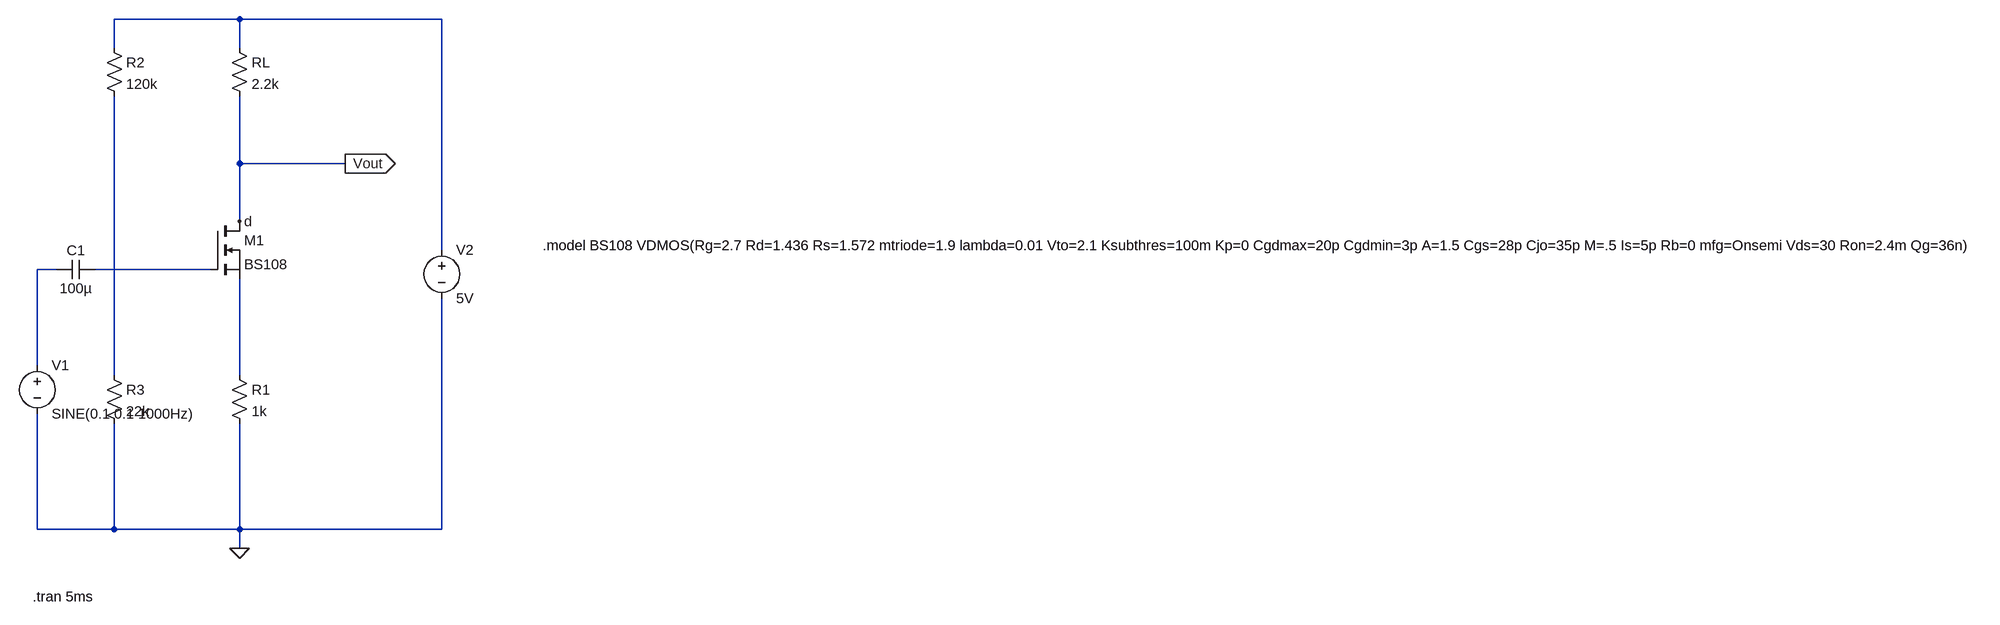
[diagram p0: schematic MOSFETasSwitchAndAmplifier.asc]
MOSFETasSwitchAndAmplifier.asc, the LTspice schematic file:
Version 4
SHEET 1 3668 784
WIRE 208 -304 0 -304
WIRE 544 -304 208 -304
WIRE 0 -256 0 -304
WIRE 208 -256 208 -304
WIRE 208 -64 208 -176
WIRE 384 -64 208 -64
WIRE 208 32 208 -64
WIRE 544 80 544 -304
WIRE -96 112 -128 112
WIRE 160 112 -32 112
WIRE -128 272 -128 112
WIRE 0 288 0 -176
WIRE 208 288 208 128
WIRE -128 544 -128 352
WIRE 0 544 0 368
WIRE 0 544 -128 544
WIRE 208 544 208 368
WIRE 208 544 0 544
WIRE 544 544 544 160
WIRE 544 544 208 544
WIRE 208 576 208 544
FLAG 208 32 d
FLAG 208 576 0
FLAG 384 -64 Vout
IOPIN 384 -64 Out
SYMBOL res 192 -272 R0
SYMATTR InstName RL
SYMATTR Value 2.2k
SYMBOL nmos 160 32 R0
SYMATTR InstName M1
SYMATTR Value BS108
SYMBOL voltage -128 256 R0
SYMATTR InstName V1
SYMATTR Value SINE(0.1 0.1 1000Hz)
SYMATTR Value2 AC 0.1
SYMBOL res 192 272 R0
SYMATTR InstName R1
SYMATTR Value 1k
SYMBOL res -16 -272 R0
SYMATTR InstName R2
SYMATTR Value 120k
SYMBOL res -16 272 R0
SYMATTR InstName R3
SYMATTR Value 22k
SYMBOL voltage 544 64 R0
SYMATTR InstName V2
SYMATTR Value 5V
SYMBOL cap -32 96 R90
WINDOW 0 0 32 VBottom 2
WINDOW 3 32 32 VTop 2
SYMATTR InstName C1
SYMATTR Value 100µ
TEXT -136 656 Left 2 !.tran 5ms
TEXT 712 72 Left 2 !.model BS108 VDMOS(Rg=2.7 Rd=1.436 Rs=1.572 mtriode=1.9 lambda=0.01 Vto=2.1 Ksubthres=100m Kp=0 Cgdmax=20p Cgdmin=3p A=1.5 Cgs=28p Cjo=35p M=.5 Is=5p Rb=0 mfg=Onsemi Vds=30 Ron=2.4m Qg=36n)

The netlist it stands for:
* MOSFETasSwitchAndAmplifier.asc
RL N001 Vout 2.2k
M1 Vout N003 N005 N005 BS108
V1 N002 0 SINE(0.1 0.1 1000Hz) AC 0.1
R1 N005 0 1k
R2 N001 N004 120k
R3 N004 0 22k
V2 N001 0 5V
C1 N003 N002 100µ
.model NMOS NMOS
.model PMOS PMOS
.lib standard.mos
.tran 5ms
.model BS108 VDMOS(Rg=2.7 Rd=1.436 Rs=1.572 mtriode=1.9 lambda=0.01 Vto=2.1 Ksubthres=100m Kp=0 Cgdmax=20p Cgdmin=3p A=1.5 Cgs=28p Cjo=35p M=.5 Is=5p Rb=0 mfg=Onsemi Vds=30 Ron=2.4m Qg=36n)
.backanno
.end